# EAGLE schematic 9-de-8 (EAGLE 6.6.0), part 2 of 2
## Sheet 3 of 3
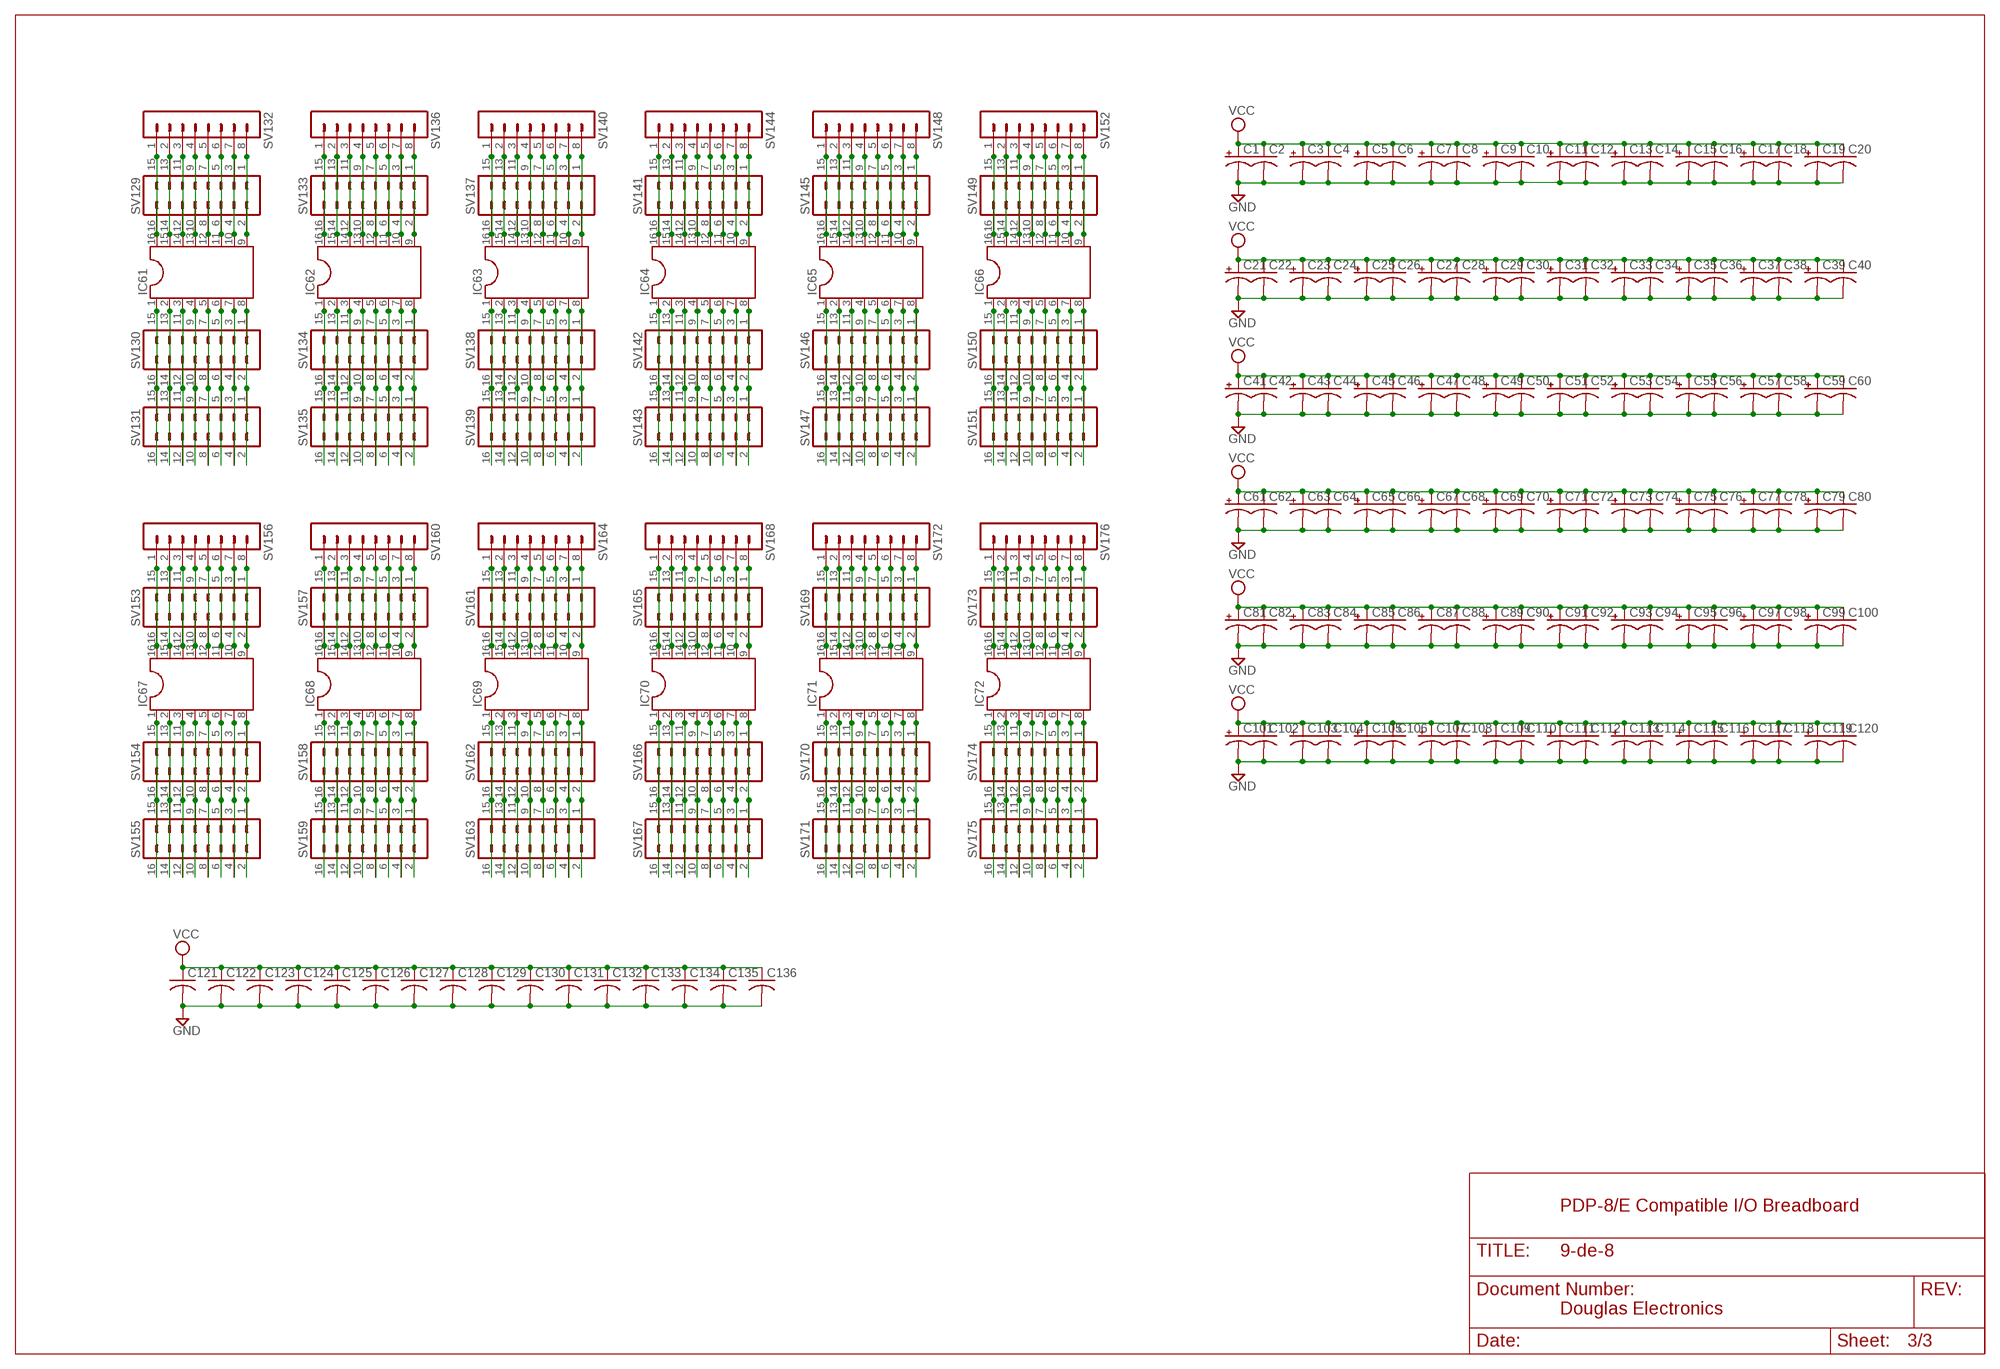
[diagram p2: schematic, sheet 3]

### Parts
C1  CPOL-USE12-4AXIAL  [E12-4]
C2  C-US050-025X075  [C050-025X075]
C3  CPOL-USE12-4AXIAL  [E12-4]
C4  C-US050-025X075  [C050-025X075]
C5  CPOL-USE12-4AXIAL  [E12-4]
C6  C-US050-025X075  [C050-025X075]
C7  CPOL-USE12-4AXIAL  [E12-4]
C8  C-US050-025X075  [C050-025X075]
C9  CPOL-USE12-4AXIAL  [E12-4]
C10  C-US050-025X075  [C050-025X075]
C11  CPOL-USE12-4AXIAL  [E12-4]
C12  C-US050-025X075  [C050-025X075]
C13  CPOL-USE12-4AXIAL  [E12-4]
C14  C-US050-025X075  [C050-025X075]
C15  CPOL-USE12-4AXIAL  [E12-4]
C16  C-US050-025X075  [C050-025X075]
C17  CPOL-USE12-4AXIAL  [E12-4]
C18  C-US050-025X075  [C050-025X075]
C19  CPOL-USE12-4AXIAL  [E12-4]
C20  C-US050-025X075  [C050-025X075]
C21  CPOL-USE12-4AXIAL  [E12-4]
C22  C-US050-025X075  [C050-025X075]
C23  CPOL-USE12-4AXIAL  [E12-4]
C24  C-US050-025X075  [C050-025X075]
C25  CPOL-USE12-4AXIAL  [E12-4]
C26  C-US050-025X075  [C050-025X075]
C27  CPOL-USE12-4AXIAL  [E12-4]
C28  C-US050-025X075  [C050-025X075]
C29  CPOL-USE12-4AXIAL  [E12-4]
C30  C-US050-025X075  [C050-025X075]
C31  CPOL-USE12-4AXIAL  [E12-4]
C32  C-US050-025X075  [C050-025X075]
C33  CPOL-USE12-4AXIAL  [E12-4]
C34  C-US050-025X075  [C050-025X075]
C35  CPOL-USE12-4AXIAL  [E12-4]
C36  C-US050-025X075  [C050-025X075]
C37  CPOL-USE12-4AXIAL  [E12-4]
C38  C-US050-025X075  [C050-025X075]
C39  CPOL-USE12-4AXIAL  [E12-4]
C40  C-US050-025X075  [C050-025X075]
C41  CPOL-USE12-4AXIAL  [E12-4]
C42  C-US050-025X075  [C050-025X075]
C43  CPOL-USE12-4AXIAL  [E12-4]
C44  C-US050-025X075  [C050-025X075]
C45  CPOL-USE12-4AXIAL  [E12-4]
C46  C-US050-025X075  [C050-025X075]
C47  CPOL-USE12-4AXIAL  [E12-4]
C48  C-US050-025X075  [C050-025X075]
C49  CPOL-USE12-4AXIAL  [E12-4]
C50  C-US050-025X075  [C050-025X075]
C51  CPOL-USE12-4AXIAL  [E12-4]
C52  C-US050-025X075  [C050-025X075]
C53  CPOL-USE12-4AXIAL  [E12-4]
C54  C-US050-025X075  [C050-025X075]
C55  CPOL-USE12-4AXIAL  [E12-4]
C56  C-US050-025X075  [C050-025X075]
C57  CPOL-USE12-4AXIAL  [E12-4]
C58  C-US050-025X075  [C050-025X075]
C59  CPOL-USE12-4AXIAL  [E12-4]
C60  C-US050-025X075  [C050-025X075]
C61  CPOL-USE12-4AXIAL  [E12-4]
C62  C-US050-025X075  [C050-025X075]
C63  CPOL-USE12-4AXIAL  [E12-4]
C64  C-US050-025X075  [C050-025X075]
C65  CPOL-USE12-4AXIAL  [E12-4]
C66  C-US050-025X075  [C050-025X075]
C67  CPOL-USE12-4AXIAL  [E12-4]
C68  C-US050-025X075  [C050-025X075]
C69  CPOL-USE12-4AXIAL  [E12-4]
C70  C-US050-025X075  [C050-025X075]
C71  CPOL-USE12-4AXIAL  [E12-4]
C72  C-US050-025X075  [C050-025X075]
C73  CPOL-USE12-4AXIAL  [E12-4]
C74  C-US050-025X075  [C050-025X075]
C75  CPOL-USE12-4AXIAL  [E12-4]
C76  C-US050-025X075  [C050-025X075]
C77  CPOL-USE12-4AXIAL  [E12-4]
C78  C-US050-025X075  [C050-025X075]
C79  CPOL-USE12-4AXIAL  [E12-4]
C80  C-US050-025X075  [C050-025X075]
C81  CPOL-USE12-4AXIAL  [E12-4]
C82  C-US050-025X075  [C050-025X075]
C83  CPOL-USE12-4AXIAL  [E12-4]
C84  C-US050-025X075  [C050-025X075]
C85  CPOL-USE12-4AXIAL  [E12-4]
C86  C-US050-025X075  [C050-025X075]
C87  CPOL-USE12-4AXIAL  [E12-4]
C88  C-US050-025X075  [C050-025X075]
C89  CPOL-USE12-4AXIAL  [E12-4]
C90  C-US050-025X075  [C050-025X075]
C91  CPOL-USE12-4AXIAL  [E12-4]
C92  C-US050-025X075  [C050-025X075]
C93  CPOL-USE12-4AXIAL  [E12-4]
C94  C-US050-025X075  [C050-025X075]
C95  CPOL-USE12-4AXIAL  [E12-4]
C96  C-US050-025X075  [C050-025X075]
C97  CPOL-USE12-4AXIAL  [E12-4]
C98  C-US050-025X075  [C050-025X075]
C99  CPOL-USE12-4AXIAL  [E12-4]
C100  C-US050-025X075  [C050-025X075]
C101  CPOL-USE12-4AXIAL  [E12-4]
C102  C-US050-025X075  [C050-025X075]
C103  CPOL-USE12-4AXIAL  [E12-4]
C104  C-US050-025X075  [C050-025X075]
C105  CPOL-USE12-4AXIAL  [E12-4]
C106  C-US050-025X075  [C050-025X075]
C107  CPOL-USE12-4AXIAL  [E12-4]
C108  C-US050-025X075  [C050-025X075]
C109  CPOL-USE12-4AXIAL  [E12-4]
C110  C-US050-025X075  [C050-025X075]
C111  CPOL-USE12-4AXIAL  [E12-4]
C112  C-US050-025X075  [C050-025X075]
C113  CPOL-USE12-4AXIAL  [E12-4]
C114  C-US050-025X075  [C050-025X075]
C115  CPOL-USE12-4AXIAL  [E12-4]
C116  C-US050-025X075  [C050-025X075]
C117  CPOL-USE12-4AXIAL  [E12-4]
C118  C-US050-025X075  [C050-025X075]
C119  CPOL-USE12-4AXIAL  [E12-4]
C120  C-US050-025X075  [C050-025X075]
C121  C-US075-032X103  [C075-032X103]
C122  C-US075-032X103  [C075-032X103]
C123  C-US075-032X103  [C075-032X103]
C124  C-US075-032X103  [C075-032X103]
C125  C-US075-032X103  [C075-032X103]
C126  C-US075-032X103  [C075-032X103]
C127  C-US075-032X103  [C075-032X103]
C128  C-US075-032X103  [C075-032X103]
C129  C-US075-032X103  [C075-032X103]
C130  C-US075-032X103  [C075-032X103]
C131  C-US075-032X103  [C075-032X103]
C132  C-US075-032X103  [C075-032X103]
C133  C-US075-032X103  [C075-032X103]
C134  C-US075-032X103  [C075-032X103]
C135  C-US075-032X103  [C075-032X103]
C136  C-US075-032X103  [C075-032X103]
IC61  DIL16  [DIL16]
IC62  DIL16  [DIL16]
IC63  DIL16  [DIL16]
IC64  DIL16  [DIL16]
IC65  DIL16  [DIL16]
IC66  DIL16  [DIL16]
IC67  DIL16  [DIL16]
IC68  DIL16  [DIL16]
IC69  DIL16  [DIL16]
IC70  DIL16  [DIL16]
IC71  DIL16  [DIL16]
IC72  DIL16  [DIL16]
SV129  MA08-2  [MA08-2]
SV130  MA08-2  [MA08-2]
SV131  MA08-2  [MA08-2]
SV132  MA08-1  [MA08-1]
SV133  MA08-2  [MA08-2]
SV134  MA08-2  [MA08-2]
SV135  MA08-2  [MA08-2]
SV136  MA08-1  [MA08-1]
SV137  MA08-2  [MA08-2]
SV138  MA08-2  [MA08-2]
SV139  MA08-2  [MA08-2]
SV140  MA08-1  [MA08-1]
SV141  MA08-2  [MA08-2]
SV142  MA08-2  [MA08-2]
SV143  MA08-2  [MA08-2]
SV144  MA08-1  [MA08-1]
SV145  MA08-2  [MA08-2]
SV146  MA08-2  [MA08-2]
SV147  MA08-2  [MA08-2]
SV148  MA08-1  [MA08-1]
SV149  MA08-2  [MA08-2]
SV150  MA08-2  [MA08-2]
SV151  MA08-2  [MA08-2]
SV152  MA08-1  [MA08-1]
SV153  MA08-2  [MA08-2]
SV154  MA08-2  [MA08-2]
SV155  MA08-2  [MA08-2]
SV156  MA08-1  [MA08-1]
SV157  MA08-2  [MA08-2]
SV158  MA08-2  [MA08-2]
SV159  MA08-2  [MA08-2]
SV160  MA08-1  [MA08-1]
SV161  MA08-2  [MA08-2]
SV162  MA08-2  [MA08-2]
SV163  MA08-2  [MA08-2]
SV164  MA08-1  [MA08-1]
SV165  MA08-2  [MA08-2]
SV166  MA08-2  [MA08-2]
SV167  MA08-2  [MA08-2]
SV168  MA08-1  [MA08-1]
SV169  MA08-2  [MA08-2]
SV170  MA08-2  [MA08-2]
SV171  MA08-2  [MA08-2]
SV172  MA08-1  [MA08-1]
SV173  MA08-2  [MA08-2]
SV174  MA08-2  [MA08-2]
SV175  MA08-2  [MA08-2]
SV176  MA08-1  [MA08-1]

### Nets
GND [supply]: C1.- C2.2 C3.- C4.2 C5.- C6.2 C7.- C8.2 C9.- C10.2 C11.- C12.2 C13.- C14.2 C15.- C16.2 C17.- C18.2 C19.- C20.2 C21.- C22.2 C23.- C24.2 C25.- C26.2 C27.- C28.2 C29.- C30.2 C31.- C32.2 C33.- C34.2 C35.- C36.2 C37.- C38.2 C39.- C40.2 C41.- C42.2 C43.- C44.2 C45.- C46.2 C47.- C48.2 C49.- C50.2 C51.- C52.2 C53.- C54.2 C55.- C56.2 C57.- C58.2 C59.- C60.2 C61.- C62.2 C63.- C64.2 C65.- C66.2 C67.- C68.2 C69.- C70.2 C71.- C72.2 C73.- C74.2 C75.- C76.2 C77.- C78.2 C79.- C80.2 C81.- C82.2 C83.- C84.2 C85.- C86.2 C87.- C88.2 C89.- C90.2 C91.- C92.2 C93.- C94.2 C95.- C96.2 C97.- C98.2 C99.- C100.2 C101.- C102.2 C103.- C104.2 C105.- C106.2 C107.- C108.2 C109.- C110.2 C111.- C112.2 C113.- C114.2 C115.- C116.2 C117.- C118.2 C119.- C120.2 C121.2 C122.2 C123.2 C124.2 C125.2 C126.2 C127.2 C128.2 C129.2 C130.2 C131.2 C132.2 C133.2 C134.2 C135.2 C136.2 ; also sheet 1
N$1146: IC61.9 SV129.1 SV129.2 SV132.8
N$1147: IC62.6 SV134.5 SV134.6 SV135.5 SV135.6
N$1148: IC61.11 SV129.5 SV129.6 SV132.6
N$1149: IC61.12 SV129.7 SV129.8 SV132.5
N$1150: IC61.13 SV129.9 SV129.10 SV132.4
N$1151: IC61.14 SV129.11 SV129.12 SV132.3
N$1152: IC62.16 SV133.15 SV133.16 SV136.1
N$1153: IC61.16 SV129.15 SV129.16 SV132.1
N$1154: IC61.8 SV130.1 SV130.2 SV131.1 SV131.2
N$1155: IC62.15 SV133.13 SV133.14 SV136.2
N$1156: IC61.6 SV130.5 SV130.6 SV131.5 SV131.6
N$1157: IC62.14 SV133.11 SV133.12 SV136.3
N$1158: IC62.13 SV133.9 SV133.10 SV136.4
N$1159: IC62.12 SV133.7 SV133.8 SV136.5
N$1160: IC62.11 SV133.5 SV133.6 SV136.6
N$1161: IC62.10 SV133.3 SV133.4 SV136.7
N$1162: IC62.9 SV133.1 SV133.2 SV136.8
N$1163: IC61.7 SV130.3 SV130.4 SV131.3 SV131.4
N$1164: IC62.1 SV134.15 SV134.16 SV135.15 SV135.16
N$1165: IC61.5 SV130.7 SV130.8 SV131.7 SV131.8
N$1166: IC61.4 SV130.9 SV130.10 SV131.9 SV131.10
N$1167: IC61.3 SV130.11 SV130.12 SV131.11 SV131.12
N$1168: IC61.2 SV130.13 SV130.14 SV131.13 SV131.14
N$1169: IC61.1 SV130.15 SV130.16 SV131.15 SV131.16
N$1170: IC62.8 SV134.1 SV134.2 SV135.1 SV135.2
N$1171: IC61.15 SV129.13 SV129.14 SV132.2
N$1172: IC62.7 SV134.3 SV134.4 SV135.3 SV135.4
N$1173: IC62.5 SV134.7 SV134.8 SV135.7 SV135.8
N$1174: IC62.4 SV134.9 SV134.10 SV135.9 SV135.10
N$1175: IC62.3 SV134.11 SV134.12 SV135.11 SV135.12
N$1176: IC61.10 SV129.3 SV129.4 SV132.7
N$1177: IC62.2 SV134.13 SV134.14 SV135.13 SV135.14
N$1178: IC63.6 SV138.5 SV138.6 SV139.5 SV139.6
N$1179: IC63.16 SV137.15 SV137.16 SV140.1
N$1180: IC63.15 SV137.13 SV137.14 SV140.2
N$1181: IC63.14 SV137.11 SV137.12 SV140.3
N$1182: IC63.13 SV137.9 SV137.10 SV140.4
N$1183: IC63.12 SV137.7 SV137.8 SV140.5
N$1184: IC63.11 SV137.5 SV137.6 SV140.6
N$1185: IC63.10 SV137.3 SV137.4 SV140.7
N$1186: IC63.9 SV137.1 SV137.2 SV140.8
N$1187: IC63.1 SV138.15 SV138.16 SV139.15 SV139.16
N$1188: IC63.8 SV138.1 SV138.2 SV139.1 SV139.2
N$1189: IC63.7 SV138.3 SV138.4 SV139.3 SV139.4
N$1190: IC63.5 SV138.7 SV138.8 SV139.7 SV139.8
N$1191: IC63.4 SV138.9 SV138.10 SV139.9 SV139.10
N$1192: IC63.3 SV138.11 SV138.12 SV139.11 SV139.12
N$1193: IC63.2 SV138.13 SV138.14 SV139.13 SV139.14
N$1194: IC64.6 SV142.5 SV142.6 SV143.5 SV143.6
N$1195: IC64.16 SV141.15 SV141.16 SV144.1
N$1196: IC64.15 SV141.13 SV141.14 SV144.2
N$1197: IC64.14 SV141.11 SV141.12 SV144.3
N$1198: IC64.13 SV141.9 SV141.10 SV144.4
N$1199: IC64.12 SV141.7 SV141.8 SV144.5
N$1200: IC64.11 SV141.5 SV141.6 SV144.6
N$1201: IC64.10 SV141.3 SV141.4 SV144.7
N$1202: IC64.9 SV141.1 SV141.2 SV144.8
N$1203: IC64.1 SV142.15 SV142.16 SV143.15 SV143.16
N$1204: IC64.8 SV142.1 SV142.2 SV143.1 SV143.2
N$1205: IC64.7 SV142.3 SV142.4 SV143.3 SV143.4
N$1206: IC64.5 SV142.7 SV142.8 SV143.7 SV143.8
N$1207: IC64.4 SV142.9 SV142.10 SV143.9 SV143.10
N$1208: IC64.3 SV142.11 SV142.12 SV143.11 SV143.12
N$1209: IC64.2 SV142.13 SV142.14 SV143.13 SV143.14
N$1210: IC65.6 SV146.5 SV146.6 SV147.5 SV147.6
N$1211: IC65.16 SV145.15 SV145.16 SV148.1
N$1212: IC65.15 SV145.13 SV145.14 SV148.2
N$1213: IC65.14 SV145.11 SV145.12 SV148.3
N$1214: IC65.13 SV145.9 SV145.10 SV148.4
N$1215: IC65.12 SV145.7 SV145.8 SV148.5
N$1216: IC65.11 SV145.5 SV145.6 SV148.6
N$1217: IC65.10 SV145.3 SV145.4 SV148.7
N$1218: IC65.9 SV145.1 SV145.2 SV148.8
N$1219: IC65.1 SV146.15 SV146.16 SV147.15 SV147.16
N$1220: IC65.8 SV146.1 SV146.2 SV147.1 SV147.2
N$1221: IC65.7 SV146.3 SV146.4 SV147.3 SV147.4
N$1222: IC65.5 SV146.7 SV146.8 SV147.7 SV147.8
N$1223: IC65.4 SV146.9 SV146.10 SV147.9 SV147.10
N$1224: IC65.3 SV146.11 SV146.12 SV147.11 SV147.12
N$1225: IC65.2 SV146.13 SV146.14 SV147.13 SV147.14
N$1226: IC66.6 SV150.5 SV150.6 SV151.5 SV151.6
N$1227: IC66.16 SV149.15 SV149.16 SV152.1
N$1228: IC66.15 SV149.13 SV149.14 SV152.2
N$1229: IC66.14 SV149.11 SV149.12 SV152.3
N$1230: IC66.13 SV149.9 SV149.10 SV152.4
N$1231: IC66.12 SV149.7 SV149.8 SV152.5
N$1232: IC66.11 SV149.5 SV149.6 SV152.6
N$1233: IC66.10 SV149.3 SV149.4 SV152.7
N$1234: IC66.9 SV149.1 SV149.2 SV152.8
N$1235: IC66.1 SV150.15 SV150.16 SV151.15 SV151.16
N$1236: IC66.8 SV150.1 SV150.2 SV151.1 SV151.2
N$1237: IC66.7 SV150.3 SV150.4 SV151.3 SV151.4
N$1238: IC66.5 SV150.7 SV150.8 SV151.7 SV151.8
N$1239: IC66.4 SV150.9 SV150.10 SV151.9 SV151.10
N$1240: IC66.3 SV150.11 SV150.12 SV151.11 SV151.12
N$1241: IC66.2 SV150.13 SV150.14 SV151.13 SV151.14
N$1242: IC67.6 SV154.5 SV154.6 SV155.5 SV155.6
N$1243: IC67.16 SV153.15 SV153.16 SV156.1
N$1244: IC67.15 SV153.13 SV153.14 SV156.2
N$1245: IC67.14 SV153.11 SV153.12 SV156.3
N$1246: IC67.13 SV153.9 SV153.10 SV156.4
N$1247: IC67.12 SV153.7 SV153.8 SV156.5
N$1248: IC67.11 SV153.5 SV153.6 SV156.6
N$1249: IC67.10 SV153.3 SV153.4 SV156.7
N$1250: IC67.9 SV153.1 SV153.2 SV156.8
N$1251: IC67.1 SV154.15 SV154.16 SV155.15 SV155.16
N$1252: IC67.8 SV154.1 SV154.2 SV155.1 SV155.2
N$1253: IC67.7 SV154.3 SV154.4 SV155.3 SV155.4
N$1254: IC67.5 SV154.7 SV154.8 SV155.7 SV155.8
N$1255: IC67.4 SV154.9 SV154.10 SV155.9 SV155.10
N$1256: IC67.3 SV154.11 SV154.12 SV155.11 SV155.12
N$1257: IC67.2 SV154.13 SV154.14 SV155.13 SV155.14
N$1258: IC68.6 SV158.5 SV158.6 SV159.5 SV159.6
N$1259: IC68.16 SV157.15 SV157.16 SV160.1
N$1260: IC68.15 SV157.13 SV157.14 SV160.2
N$1261: IC68.14 SV157.11 SV157.12 SV160.3
N$1262: IC68.13 SV157.9 SV157.10 SV160.4
N$1263: IC68.12 SV157.7 SV157.8 SV160.5
N$1264: IC68.11 SV157.5 SV157.6 SV160.6
N$1265: IC68.10 SV157.3 SV157.4 SV160.7
N$1266: IC68.9 SV157.1 SV157.2 SV160.8
N$1267: IC68.1 SV158.15 SV158.16 SV159.15 SV159.16
N$1268: IC68.8 SV158.1 SV158.2 SV159.1 SV159.2
N$1269: IC68.7 SV158.3 SV158.4 SV159.3 SV159.4
N$1270: IC68.5 SV158.7 SV158.8 SV159.7 SV159.8
N$1271: IC68.4 SV158.9 SV158.10 SV159.9 SV159.10
N$1272: IC68.3 SV158.11 SV158.12 SV159.11 SV159.12
N$1273: IC68.2 SV158.13 SV158.14 SV159.13 SV159.14
N$1274: IC69.6 SV162.5 SV162.6 SV163.5 SV163.6
N$1275: IC69.16 SV161.15 SV161.16 SV164.1
N$1276: IC69.15 SV161.13 SV161.14 SV164.2
N$1277: IC69.14 SV161.11 SV161.12 SV164.3
N$1278: IC69.13 SV161.9 SV161.10 SV164.4
N$1279: IC69.12 SV161.7 SV161.8 SV164.5
N$1280: IC69.11 SV161.5 SV161.6 SV164.6
N$1281: IC69.10 SV161.3 SV161.4 SV164.7
N$1282: IC69.9 SV161.1 SV161.2 SV164.8
N$1283: IC69.1 SV162.15 SV162.16 SV163.15 SV163.16
N$1284: IC69.8 SV162.1 SV162.2 SV163.1 SV163.2
N$1285: IC69.7 SV162.3 SV162.4 SV163.3 SV163.4
N$1286: IC69.5 SV162.7 SV162.8 SV163.7 SV163.8
N$1287: IC69.4 SV162.9 SV162.10 SV163.9 SV163.10
N$1288: IC69.3 SV162.11 SV162.12 SV163.11 SV163.12
N$1289: IC69.2 SV162.13 SV162.14 SV163.13 SV163.14
N$1290: IC70.6 SV166.5 SV166.6 SV167.5 SV167.6
N$1291: IC70.16 SV165.15 SV165.16 SV168.1
N$1292: IC70.15 SV165.13 SV165.14 SV168.2
N$1293: IC70.14 SV165.11 SV165.12 SV168.3
N$1294: IC70.13 SV165.9 SV165.10 SV168.4
N$1295: IC70.12 SV165.7 SV165.8 SV168.5
N$1296: IC70.11 SV165.5 SV165.6 SV168.6
N$1297: IC70.10 SV165.3 SV165.4 SV168.7
N$1298: IC70.9 SV165.1 SV165.2 SV168.8
N$1299: IC70.1 SV166.15 SV166.16 SV167.15 SV167.16
N$1300: IC70.8 SV166.1 SV166.2 SV167.1 SV167.2
N$1301: IC70.7 SV166.3 SV166.4 SV167.3 SV167.4
N$1302: IC70.5 SV166.7 SV166.8 SV167.7 SV167.8
N$1303: IC70.4 SV166.9 SV166.10 SV167.9 SV167.10
N$1304: IC70.3 SV166.11 SV166.12 SV167.11 SV167.12
N$1305: IC70.2 SV166.13 SV166.14 SV167.13 SV167.14
N$1306: IC71.6 SV170.5 SV170.6 SV171.5 SV171.6
N$1307: IC71.16 SV169.15 SV169.16 SV172.1
N$1308: IC71.15 SV169.13 SV169.14 SV172.2
N$1309: IC71.14 SV169.11 SV169.12 SV172.3
N$1310: IC71.13 SV169.9 SV169.10 SV172.4
N$1311: IC71.12 SV169.7 SV169.8 SV172.5
N$1312: IC71.11 SV169.5 SV169.6 SV172.6
N$1313: IC71.10 SV169.3 SV169.4 SV172.7
N$1314: IC71.9 SV169.1 SV169.2 SV172.8
N$1315: IC71.1 SV170.15 SV170.16 SV171.15 SV171.16
N$1316: IC71.8 SV170.1 SV170.2 SV171.1 SV171.2
N$1317: IC71.7 SV170.3 SV170.4 SV171.3 SV171.4
N$1318: IC71.5 SV170.7 SV170.8 SV171.7 SV171.8
N$1319: IC71.4 SV170.9 SV170.10 SV171.9 SV171.10
N$1320: IC71.3 SV170.11 SV170.12 SV171.11 SV171.12
N$1321: IC71.2 SV170.13 SV170.14 SV171.13 SV171.14
N$1322: IC72.6 SV174.5 SV174.6 SV175.5 SV175.6
N$1323: IC72.16 SV173.15 SV173.16 SV176.1
N$1324: IC72.15 SV173.13 SV173.14 SV176.2
N$1325: IC72.14 SV173.11 SV173.12 SV176.3
N$1326: IC72.13 SV173.9 SV173.10 SV176.4
N$1327: IC72.12 SV173.7 SV173.8 SV176.5
N$1328: IC72.11 SV173.5 SV173.6 SV176.6
N$1329: IC72.10 SV173.3 SV173.4 SV176.7
N$1330: IC72.9 SV173.1 SV173.2 SV176.8
N$1331: IC72.1 SV174.15 SV174.16 SV175.15 SV175.16
N$1332: IC72.8 SV174.1 SV174.2 SV175.1 SV175.2
N$1333: IC72.7 SV174.3 SV174.4 SV175.3 SV175.4
N$1334: IC72.5 SV174.7 SV174.8 SV175.7 SV175.8
N$1335: IC72.4 SV174.9 SV174.10 SV175.9 SV175.10
N$1336: IC72.3 SV174.11 SV174.12 SV175.11 SV175.12
N$1337: IC72.2 SV174.13 SV174.14 SV175.13 SV175.14
VCC [supply]: C1.+ C2.1 C3.+ C4.1 C5.+ C6.1 C7.+ C8.1 C9.+ C10.1 C11.+ C12.1 C13.+ C14.1 C15.+ C16.1 C17.+ C18.1 C19.+ C20.1 C21.+ C22.1 C23.+ C24.1 C25.+ C26.1 C27.+ C28.1 C29.+ C30.1 C31.+ C32.1 C33.+ C34.1 C35.+ C36.1 C37.+ C38.1 C39.+ C40.1 C41.+ C42.1 C43.+ C44.1 C45.+ C46.1 C47.+ C48.1 C49.+ C50.1 C51.+ C52.1 C53.+ C54.1 C55.+ C56.1 C57.+ C58.1 C59.+ C60.1 C61.+ C62.1 C63.+ C64.1 C65.+ C66.1 C67.+ C68.1 C69.+ C70.1 C71.+ C72.1 C73.+ C74.1 C75.+ C76.1 C77.+ C78.1 C79.+ C80.1 C81.+ C82.1 C83.+ C84.1 C85.+ C86.1 C87.+ C88.1 C89.+ C90.1 C91.+ C92.1 C93.+ C94.1 C95.+ C96.1 C97.+ C98.1 C99.+ C100.1 C101.+ C102.1 C103.+ C104.1 C105.+ C106.1 C107.+ C108.1 C109.+ C110.1 C111.+ C112.1 C113.+ C114.1 C115.+ C116.1 C117.+ C118.1 C119.+ C120.1 C121.1 C122.1 C123.1 C124.1 C125.1 C126.1 C127.1 C128.1 C129.1 C130.1 C131.1 C132.1 C133.1 C134.1 C135.1 C136.1 ; also sheet 1

### Notes on the sheet
- PDP-8/E Compatible I/O Breadboard
- Douglas Electronics

## Library data of the parts
C1 C3 C5 C7 C9 C11 C13 C15 C17 C19 C21 C23 C25 C27 C29 C31 C33 C35 C37 C39 C41 C43 C45 C47 C49 C51 C53 C55 C57 C59 C61 C63 C65 C67 C69 C71 C73 C75 C77 C79 C81 C83 C85 C87 C89 C91 C93 C95 C97 C99 C101 C103 C105 C107 C109 C111 C113 C115 C117 C119 = dec-con:CPOL-USE12-4AXIAL: 0.5" veresion of an electrolytic
C2 C4 C6 C8 C10 C12 C14 C16 C18 C20 C22 C24 C26 C28 C30 C32 C34 C36 C38 C40 C42 C44 C46 C48 C50 C52 C54 C56 C58 C60 C62 C64 C66 C68 C70 C72 C74 C76 C78 C80 C82 C84 C86 C88 C90 C92 C94 C96 C98 C100 C102 C104 C106 C108 C110 C112 C114 C116 C118 C120-C136 = rcl:C-US: CAPACITOR, American symbol
IC1-IC72 = ic-package:DIL16: Dual In Line / Socket
JA1 JA2 JB1 JB2 JC1 JC2 JD1 JD2 = dec-con:MA18-1
SV1-SV120 SV129-SV131 SV133-SV135 SV137-SV139 SV141-SV143 SV145-SV147 SV149-SV151 SV153-SV155 SV157-SV159 SV161-SV163 SV165-SV167 SV169-SV171 SV173-SV175 = con-lstb:MA08-2: PIN HEADER; OC_FARNELL: unknown; OC_NEWARK: unknown
SV121-SV128 = con-lstb:MA20-2: PIN HEADER; OC_FARNELL: unknown; OC_NEWARK: unknown
SV132 SV136 SV140 SV144 SV148 SV152 SV156 SV160 SV164 SV168 SV172 SV176 = con-lstb:MA08-1: PIN HEADER; OC_FARNELL: unknown; OC_NEWARK: unknown
U$1 = dec-con:OUTLINE-*: Board outlines for DEC boards.
U$2 = dec-con:QUAD: Quad-Height DEC board

## Net classes
1 supply: width 0.813 mm